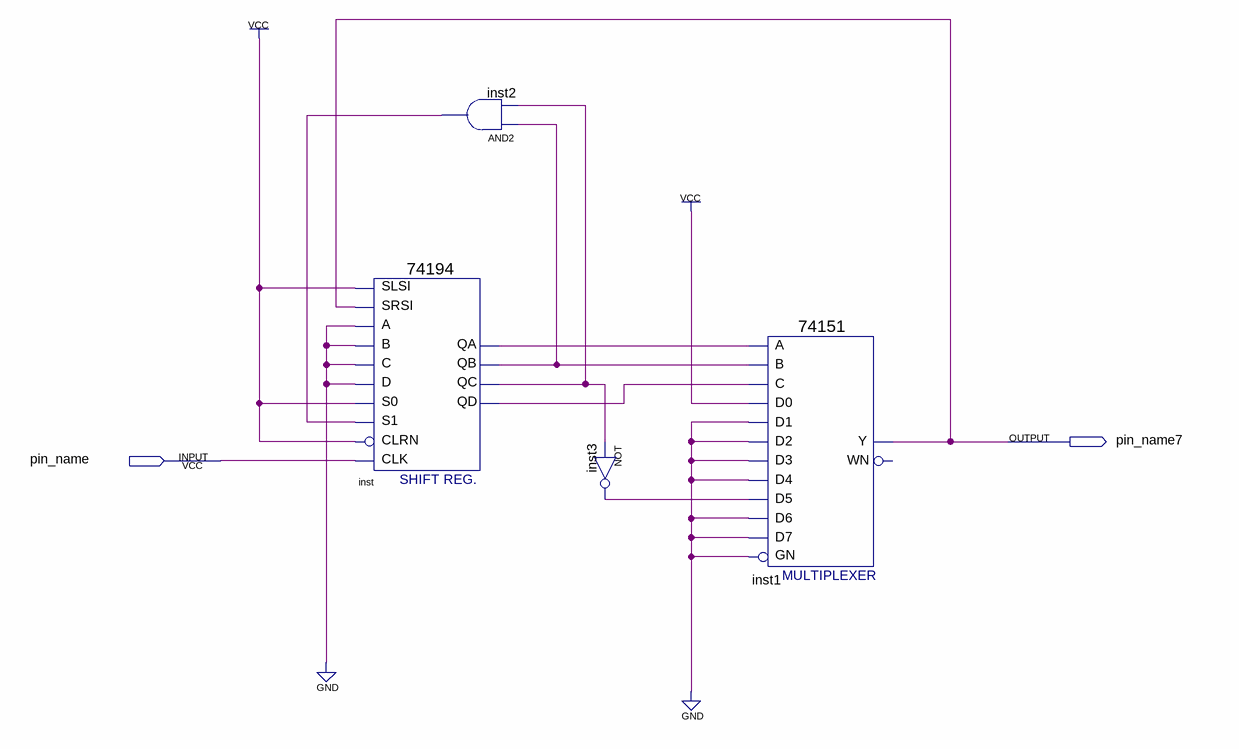
[diagram p0: schematic sheet]
// Quartus schematic 194demo.bdf as structural Verilog: 4 symbols, 2 pins
module \194demo  (
  input  pin_name,
  output pin_name7
);

  wire inst2_out, inst3_out, inst_qa, inst_qb, inst_qc, inst_qd;

  \74194  inst (
    .SLSI(1'b1), .SRSI(pin_name7), .B(1'b0), .C(1'b0), .CLK(pin_name), .CLRN(1'b1), .D(1'b0), .S1(inst2_out),
    .S0(1'b1), .A(1'b0), .QA(inst_qa), .QB(inst_qb), .QC(inst_qc), .QD(inst_qd));
  and inst2 (inst2_out, inst_qb, inst_qc);
  not inst3 (inst3_out, inst_qc);
  \74151  inst1 (
    .GN(1'b0), .C(inst_qd), .B(inst_qb), .A(inst_qa), .D5(inst3_out), .D0(1'b1), .D1(1'b0), .D4(1'b0),
    .D3(1'b0), .D2(1'b0), .D6(1'b0), .D7(1'b0), .Y(pin_name7));  // open: WN
endmodule
